# EasyEDA Pro project STM32F103C8T6_C6T6核心板.eprj, board PCB1_MicroUSB
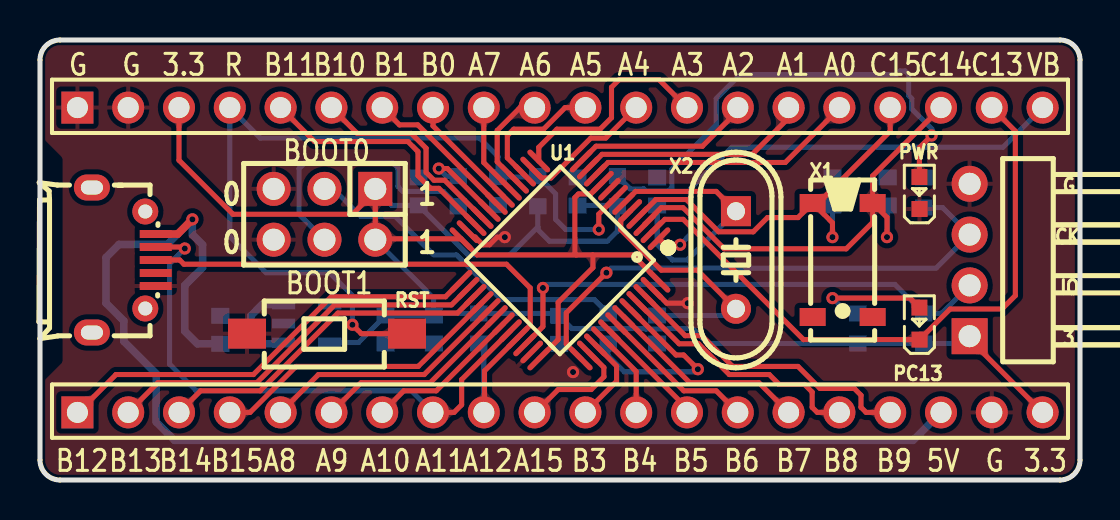
[diagram p6: board, top side]
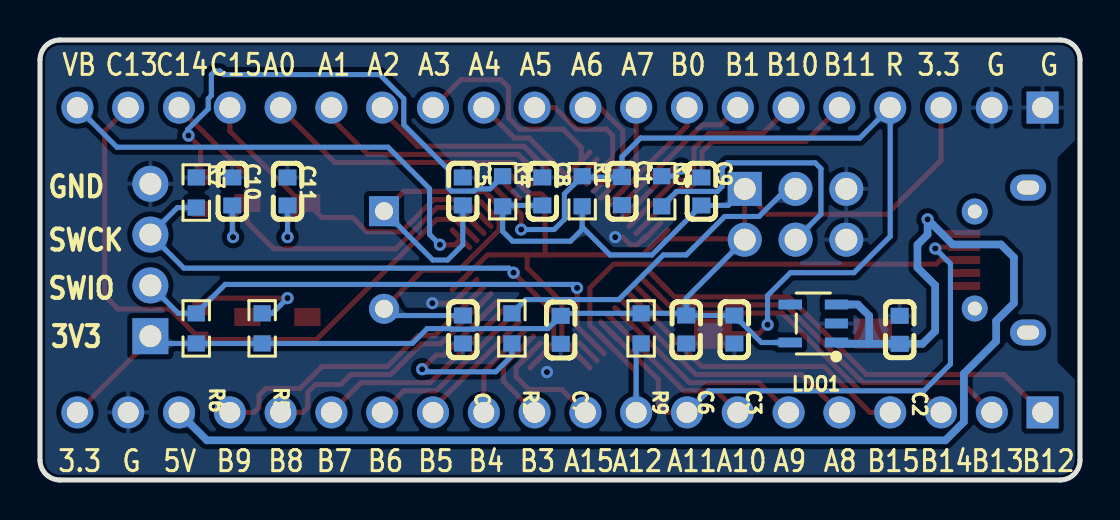
[diagram p7: board, bottom side, seen from below]

Outline 52 x 22 mm; copper layers: Top Layer, Bottom Layer. Coordinates in mm from the lower left corner of the outline.
Outline path: 0,21 0,1 arc(0.29,0.29) 1,0 51,0 arc(51.71,0.29) 52,1 52,21 arc(51.71,21.71) 51,22 1,22 arc(0.29,21.71) 0,21
Stack: Top Layer 0.035mm / Dielectric1 1.51mm FR4 er 4.5 / Bottom Layer 0.035mm

## Design rules (mm)
template: JLCPCB Capability(Two Layers Board)
spacing copperThickness1oz (default): track to track 0.102, other pairs 0.152 to 0.3
spacing copperThickness2oz: track to track 0.203, other pairs 0.152 to 0.3
track width copperThickness1oz (default): min 0.127, default 0.254, max 2.54
track width copperThickness2oz: min 0.203, default 0.254, max 2.54
differential pair differentialPair (default): width min 0.127, default 0.254, max 2.54; gap min 0.152, default 0.152
via viaSize (default): diameter min 0.5, default 0.61, max 10; hole min 0.3, default 0.305, max 6.3

## Placement (name value [footprint] x y rotation side)
C1  1uF  [C0603]  22.9 14.44 90 bottom
C2  1uF  [C0603]  9.02 7.51 270 bottom
C3  1uF  [C0603]  17.28 7.52 90 bottom
C4  20pF  [C0603]  30.86 7.52 90 bottom
C5  20pF  [C0603]  30.86 14.43 270 bottom
C6  100nF  [C0603]  19.69 7.52 90 bottom
C7  100nF  [C0603]  25.96 7.51 90 bottom
C8  100nF  [C0603]  26.88 14.43 270 bottom
C9  100nF  [C0603]  18.93 14.43 270 bottom
C10  6pF  [C0603]  42.38 14.43 270 bottom
C11  6pF  [C0603]  39.62 14.43 270 bottom
H1  PZ254V-12-6P  [HDR-TH_6P-P2.54-V-M-R2-C3-S2.54]  14.22 13.29 180 top
H2  PZ254R-11-04P  [HDR-TH_4P-P2.54-H-M-W10.4]  46.48 11 90 top
LDO1  ME6211C33M5G-N  [SOT-23-5_L3.0-W1.7-P0.95-LS2.8-BL]  13.34 7.83 90 bottom
PC13  -  [LED_0603]  43.97 7.87 90 top
PWR  -  [LED_0603]  43.97 14.4 90 top
R1  10kΩ  [R0603]  24.89 14.44 270 bottom
R2  100kΩ  [R0603]  28.41 7.58 90 bottom
R3  100kΩ  [R0603]  20.92 14.44 90 bottom
R4  510Ω  [R0603]  28.87 14.44 90 bottom
R5  510Ω  [R0603]  40.89 7.58 90 bottom
R6  10kΩ  [R0603]  44.19 7.58 270 bottom
R7  10kΩ  [R0603]  44.19 14.37 270 bottom
R9  1.5kΩ  [R0603]  21.94 7.58 90 bottom
RST  TS-1101-C-W  [SW-SMD_L6.0-W3.3-LS8.0]  14.35 7.32 0 top
U1  STM32F103C8T6  [LQFP-48_L7.0-W7.0-P0.50-LS9.0-BL]  26 11 135 top
U2  ZX-PZ2.54-1-20PZZ  [HDR-TH_20P-P2.54-V-M]  26 18.62 0 top
U3  ZX-PZ2.54-1-20PZZ  [HDR-TH_20P-P2.54-V-M]  26 3.38 0 top
USB1  MicroXNJ  [MICRO-USB-SMD_MICROXNJ]  4.19 11 270 top
X1  32.768kHz  [MC-306_4P-L8.0-W3.2-P5.5-BL]  40.13 11 270 top
X2  8MHz  [HC-49US_L11.5-W4.5-P4.88]  34.8 11 270 top

## Footprints (pads in the part's own frame, mm; a bottom-side part is the same pattern mirrored in y, then rotated)
C0603
  rect 0.8x0.9 smd: 1(-0.7,0) 2(0.7,0)
HC-49US_L11.5-W4.5-P4.88
  rect 1.5x1.5 hole 0.9: 1(-2.44,0)
  round 1.5 hole 0.9: 2(2.44,0)
HDR-TH_4P-P2.54-H-M-W10.4
  rect 1.8x1.8 hole 1.1: 1(-3.81,0)
  round 1.8 hole 1.1: 2(-1.27,0) 3(1.27,0) 4(3.81,0)
HDR-TH_6P-P2.54-V-M-R2-C3-S2.54
  rect 1.7x1.7 hole 1.1: 1(-2.54,-1.27)
  round 1.7 hole 1.1: 2(-2.54,1.27) 3(0,-1.27) 4(0,1.27) 5(2.54,-1.27) 6(2.54,1.27)
HDR-TH_20P-P2.54-V-M
  rect 1.6x1.6 hole 1.05: 1(-24.13,0)
  round 1.6 hole 1.05: 2(-21.59,0) 3(-19.05,0) 4(-16.51,0) 5(-13.97,0) 6(-11.43,0) 7(-8.89,0) 8(-6.35,0) 9(-3.81,0) 10(-1.27,0) 11(1.27,0) 12(3.81,0) 13(6.35,0) 14(8.89,0) 15(11.43,0) 16(13.97,0) 17(16.51,0) 18(19.05,0) 19(21.59,0) 20(24.13,0)
LED_0603
  rect 0.8x0.8 smd: 1(-0.851,-0.01) 2(0.75,-0.005)
LQFP-48_L7.0-W7.0-P0.50-LS9.0-BL
  oval 0.27x1.5 smd: 1(-2.75,-4.25) 2(-2.25,-4.25) 3(-1.75,-4.25) 4(-1.25,-4.25) 5(-0.75,-4.25) 6(-0.25,-4.25) 7(0.25,-4.25) 8(0.75,-4.25) 9(1.25,-4.25) 10(1.75,-4.25) 11(2.25,-4.25) 12(2.75,-4.25) 25(2.75,4.25) 26(2.25,4.25) 27(1.75,4.25) 28(1.25,4.25) 29(0.75,4.25) 30(0.25,4.25) 31(-0.25,4.25) 32(-0.75,4.25) 33(-1.25,4.25) 34(-1.75,4.25) 35(-2.25,4.25) 36(-2.75,4.25)
  oval 1.5x0.27 smd: 13(4.25,-2.75) 14(4.25,-2.25) 15(4.25,-1.75) 16(4.25,-1.25) 17(4.25,-0.75) 18(4.25,-0.25) 19(4.25,0.25) 20(4.25,0.75) 21(4.25,1.25) 22(4.25,1.75) 23(4.25,2.25) 24(4.25,2.75) 37(-4.25,2.75) 38(-4.25,2.25) 39(-4.25,1.75) 40(-4.25,1.25) 41(-4.25,0.75) 42(-4.25,0.25) 43(-4.25,-0.25) 44(-4.25,-0.75) 45(-4.25,-1.25) 46(-4.25,-1.75) 47(-4.25,-2.25) 48(-4.25,-2.75)
MC-306_4P-L8.0-W3.2-P5.5-BL
  rect 0.9x1.3 smd: 1(-2.85,-1.5) 2(2.85,-1.5) 3(2.85,1.5) 4(-2.85,1.5)
MICRO-USB-SMD_MICROXNJ
  rect 0.4x1.6 smd: 1(-1.3,1.597) 2(-0.65,1.597) 3(0,1.597) 4(0.65,1.597) 5(1.3,1.597)
  round 1.3 hole 0.7: 6(2.425,1.074) 9(-2.425,1.073)
  oval 1.3x1.8 hole 0.7x1.1: 7(3.625,-1.597) 8(-3.625,-1.597)
R0603
  rect 0.806x0.864 smd: 1(-0.753,0) 2(0.753,0)
SOT-23-5_L3.0-W1.7-P0.95-LS2.8-BL
  rect 0.49x1.157 smd: 1(-0.95,-1.153) 2(0,-1.153) 3(0.95,-1.153)
  rect 0.49x1.175 smd: 4(0.95,1.153) 5(-0.95,1.153)
SW-SMD_L6.0-W3.3-LS8.0
  rect 1.9x1.5 smd: 1(-4,0) 2(4,0)

## Nets
As in the schematic, except:
GND: C1.1 C2.1 C3.1 C4.1 C5.1 C6.1 C7.1 C8.1 C9.1 C10.1 C11.1 H1.5 H1.6 H2.4 LDO1.2 PWR.1 R7.1 RST.1 U1.8 U1.23 U1.35 U1.47 U2.1 U2.2 U3.19 USB1.5
PC13: PC13.1 U1.2 U2.19
RST: C1.2 R1.1 RST.2 U1.7 U2.4
$1N1202: PWR.2 R4.2
$1N1254: PC13.2 R5.2

Pads without a net: LDO1 4; USB1 4 6 7 8 9; X1 2 3

## Via types
v1: diameter 0.61, hole 0.305, Top Layer to Bottom Layer, 16 vias

## Routing (per net, layer and track width the routed paths; a pad name or vN(x,y) marks a point on that pad's centre or on a via; arc(x,y) is an arc through that point)
3V3: length 105.2
  Top Layer w0.254: 28.12,14.89 27.53,14.3 26.92,14.3 26.74,14.12 26.74,11.33 26.82,11.25 ; 16.76,14.43 H1.2 16.81,12.06 U1.24 21.86,11.25 26.82,11.25 ; 16.76,14.43 H1.1 ; 16.76,14.43 15.62,13.29 9.65,13.29 6.95,15.99 U2.3 ; 26.82,11.25 27.65,11.25 ; U1.48 29.63,11.25 27.65,11.25 ; U3.20 46.48,7.03 H2.1 ; 27.65,11.25 27.65,10.61 25.91,8.88 25.91,7.02 U1.36
  Bottom Layer w0.254: H2.1 46.12,6.83 R6.2 R5.1 33.38,6.83 32.64,7.57 31.45,7.57 31.42,7.54 30.29,7.54 30.26,7.57 26.6,7.57 C7.2 25.84,8.33 R9.2 19.8,8.33 C6.2 ; C8.2 28.82,13.73 R4.1 28.87,12.44 28.37,11.94 25.48,11.94 24.89,12.52 24.89,12.65 ; H1.2 19.69,9.09 C6.2 ; C6.2 C3.2 15.93,6.88 LDO1.5 ; 24.89,12.65 R1.2 ; 24.89,12.65 23.5,11.25 21.4,11.25 C9.2 17.59,13.73 H1.1
5V: length 71.4
  Top Layer w0.381: USB1.1 6.89,12.3 v1(7.62,13.03)
  Bottom Layer w0.381: 10.56,6.81 C2.2 7.87,6.81 7.24,7.44 7.24,9.73 8.13,10.62 8.13,11.76 7.62,12.27 v1(7.62,13.03) 6.37,11.78 3.95,11.78 3.3,11.13 3.3,8.84 4.19,7.95 4.19,6.94 5.81,5.32 5.81,2.91 6.73,1.98 43.65,1.98 U3.18 ; 10.56,6.81 12.11,6.81 LDO1.1 ; 10.56,6.81 10.54,6.83 10.54,8.21 11.11,8.78 LDO1.3
GND: length 4.4
  Top Layer w0.254: v1(32.38,8.84) 31.34,8.84 U1.47 ; U1.23 21.67,12.15 21.76,12.15 22.14,11.76 22.48,11.76 22.86,12.14 v1(23.24,12.14)
  vias: v1(26.65,5.4)
BOOT0: length 10.1
  Top Layer w0.254: 29.54,8.53 29.54,8.52 31.8,6.25 32.18,6.25 v1(32.89,5.54)
  Bottom Layer w0.254: v1(32.89,5.54) 32.77,5.41 29.21,5.41 28.41,6.22 R2.1
BOOT1: length 4.5
  Top Layer w0.254: v1(19.94,15.57) 20.37,15.57 22.46,13.47
  Bottom Layer w0.254: R3.2 20.32,15.19 v1(19.94,15.57)
D+: length 30
  Top Layer w0.254: USB1.3 6.98,11 7.2,10.79 23.33,10.79 24.51,9.6 24.51,7.74 22.22,5.46 22.22,3.42 U3.9
  Bottom Layer w0.254: R9.1 22.19,6.58 U3.9
D-: length 28.1
  Top Layer w0.254: v1(7.24,11.57) 7.16,11.65 USB1.2 ; U3.8 20.7,3.38 21.08,3.76 21.08,5.02 23.53,7.46
  Bottom Layer w0.254: v1(7.24,11.57) 6.48,10.81 6.48,5.79 7.81,4.46 18.57,4.46 U3.8
OSC32_IN: length 23.9
  Top Layer w0.254: U1.3 30.24,12.79 31.06,13.62 32.15,13.62 34.21,11.56 40.31,11.56 41.63,12.88 X1.4 ; U2.18 41.63,15.2 X1.4 ; X1.4 42.35,13.13 v1(42.35,12.14)
  Bottom Layer w0.254: v1(42.35,12.14) 42.38,12.18 C10.2
OSC32_OUT: length 20.6
  Top Layer w0.254: 29.89,13.12 30.79,14.02 32.32,14.02 33.93,12.41 35.66,12.41 36.37,13.12 37.9,13.12 X1.1 ; X1.1 38.92,13.85 42.51,17.44 U2.17 ; X1.1 39.62,12.86 v1(39.62,12.14)
  Bottom Layer w0.254: C11.2 v1(39.62,12.14)
OSC_IN: length 12.6
  Top Layer w0.254: 29.54,13.47 29.53,13.47 29.04,12.99 29.04,12.52 31.06,10.49 32.87,10.49 X2.2
  Bottom Layer w0.254: X2.2 34.46,8.22 C4.2
OSC_OUT: length 13.5
  Top Layer w0.254: X2.1 33.81,14.43 29.78,14.43 U1.6
  Bottom Layer w0.254: X2.1 32.36,11 31.62,11 30.86,11.76 C5.2
PA0: length 13.6
  Top Layer w0.254: U1.10 28.4,15.88 37.26,15.88 39.97,18.58 U2.16
PA1: length 11.6
  Top Layer w0.254: U1.11 28.1,16.28 35.61,16.28 37.43,18.1 U2.15
PA2: length 9
  Top Layer w0.254: U2.14 34.89,18.46 33.12,16.69 27.8,16.69 U1.12
PA3: length 11
  Top Layer w0.254: U1.13 24.94,16.64 25.84,17.54 28,17.54 28.57,18.11 28.57,19.64 28.96,20.02 30.95,20.02 U2.13
PA4: length 6.9
  Top Layer w0.254: U2.12 28.29,17.1 27.54,17.1 25.55,15.1 25.08,15.1 U1.14
PA5: length 6.8
  Top Layer w0.254: U2.11 26.26,18.62 25.18,17.54 23.69,17.54 23.37,17.22 23.37,16.11 U1.15
PA6: length 5.4
  Top Layer w0.254: U2.10 24,18.62 22.86,17.48 22.86,15.91 23.88,14.89
PA7: length 4.6
  Top Layer w0.254: 23.53,14.54 22.19,15.87 U2.9
PA8: length 12.6
  Top Layer w0.254: 22.46,8.53 19.21,5.27 13.92,5.27 U3.5
PA9: length 10.2
  Top Layer w0.254: U1.30 19.51,4.87 16.06,4.87 U3.6
PA10: length 7.9
  Top Layer w0.254: U3.7 18.19,4.46 19.81,4.46 U1.31
PA13: length 25.8
  Top Layer w0.254: v1(25.15,9.6) 25.15,7.67 U1.34
  Bottom Layer w0.254: v1(25.15,9.6) 25.32,9.78 42.74,9.78 R6.1 45.09,8.33 H2.2
PA14: length 27.3
  Top Layer w0.254: U1.37 26.31,6.8 26.31,8.36 v1(28.32,10.36)
  Bottom Layer w0.254: R7.2 45.13,13.62 H2.3 44.81,10.59 28.55,10.59 v1(28.32,10.36)
PA15: length 5.8
  Top Layer w0.254: U3.10 24.76,3.38 25.91,4.52 27.56,4.52 28.19,5.16 28.19,5.62 U1.38
PB0: length 5.9
  Top Layer w0.254: U2.8 19.65,17.7 U1.18
PB1: length 7.7
  Top Layer w0.254: U2.7 17.97,17.76 18.89,17.76 U1.19
PB3: length 4.5
  Top Layer w0.254: U1.39 28.83,5.7 28.83,4.94 U3.11
PB4: length 4.4
  Top Layer w0.254: 28.12,7.11 29.81,5.42 U3.12
PB5: length 5.7
  Top Layer w0.254: U3.13 32.35,3.59 28.47,7.46
PB6: length 7.9
  Top Layer w0.254: U3.14 33.81,4.46 32.19,4.46 U1.42
PB7: length 10.2
  Top Layer w0.254: U1.43 32.49,4.87 35.94,4.87 U3.15
PB8: length 12.8
  Top Layer w0.254: U3.16 38.86,3.38 38.61,3.63 38.61,4.4 38.23,4.78 36.96,4.78 36.46,5.27 34.47,5.27 32.93,6.81 31.96,6.81 29.89,8.88
PB9: length 15
  Top Layer w0.254: U3.17 41.3,3.38 41.05,3.63 41.05,4.24 40.71,4.58 39,4.58 37.9,5.68 34.63,5.68 33.1,7.22 32.26,7.22 U1.46
PB10: length 10.5
  Top Layer w0.254: 22.11,13.12 22.1,13.12 20.23,14.99 19.7,14.99 19.3,15.38 19.3,16.59 18.56,17.33 15.86,17.33 U2.6
PB11: length 12.9
  Top Layer w0.254: U2.5 13.73,16.92 18.39,16.92 18.9,16.42 18.9,15.21 19.53,14.58 19.94,14.58 U1.22
PB12: length 21.9
  Top Layer w0.254: U1.25 20.27,9.16 14.56,9.16 10.67,5.27 3.8,5.27 1.91,3.38 U3.1
PB13: length 19.6
  Top Layer w0.254: U1.26 20.57,8.75 14.73,8.75 10.84,4.87 5.9,4.87 U3.2
PB14: length 17.2
  Top Layer w0.254: U1.27 20.87,8.35 14.9,8.35 11.01,4.46 8.03,4.46 U3.3
PB15: length 14.9
  Top Layer w0.254: U3.4 10.5,3.38 12.8,5.68 18.91,5.68 22.11,8.88
PC13: length 31.7
  Top Layer w0.254: U2.19 48.77,17.44 48.77,9.22 48.1,8.55 45.51,8.55 PC13.1 38.17,7.02 32.16,13.03 31.24,13.03 30.62,12.41 U1.2
RST: length 42.6
  Top Layer w0.254: U1.7 27.94,13.29 v1(27.94,12.52) ; v1(15.62,7.76) 16.07,7.32 RST.2
  Bottom Layer w0.254: v1(15.62,7.76) 15.62,9.22 14.48,10.36 11.3,10.36 9.49,12.18 U2.4 11.01,17.1 21.97,17.1 22.9,16.17 C1.2 24.85,15.14 R1.1 25.78,14.3 25.78,13.03 26.29,12.52 v1(27.94,12.52)
VB: length 23.5
  Top Layer w0.254: U1.1 31.25,11.76 v1(32,11.76)
  Bottom Layer w0.254: v1(32,11.76) 32.52,12.28 32.52,14.57 34.59,16.64 48.15,16.64 U2.20
$1N988: length 16.8
  Bottom Layer w0.254: H1.3 14.67,14.56 16.05,13.18 17.76,13.18 19.69,11.25 20.83,11.25 23.06,9.02 27.72,9.02 R2.2
$1N1027: length 13.6
  Bottom Layer w0.254: R3.1 20.17,14.43 18.14,14.43 17.89,14.67 17.89,15.6 17.64,15.86 13.24,15.86 12.95,15.57 12.95,13.29 H1.4
$1N1202: length 24.6
  Top Layer w0.254: v1(44.58,17.22) 43.97,16.62 43.97,15.15
  Bottom Layer w0.254: v1(44.58,17.22) 44.6,17.25 44.6,17.54 43.59,18.55 43.59,19.07 43.43,19.22 43.43,20.27 43.25,20.45 43,20.45 42.82,20.27 35.01,20.27 33.81,19.07 33.81,17.76 31.59,15.54 31.59,14.61 31.43,14.45 30.3,14.45 30.19,14.56 29.5,14.56 R4.2
$1N1254: length 6.1
  Top Layer w0.254: v1(39.62,9.09) 43.5,9.09 PC13.2
  Bottom Layer w0.254: R5.2 40.39,8.33 v1(39.62,9.09)

## Copper pours and planes (outline as drawn; the poured copper is in the pictures)
GND on Top Layer: -2.03,25.1 54.23,25.1 54.23,-3.22 -2.03,-3.22
GND on Bottom Layer: -3.94,24.72 56.13,24.72 56.13,-4.88 -3.94,-4.88

Small or netless copper shapes (teardrops, artwork), in the pictures only: 74 on Top Layer, 70 on Bottom Layer

## Text on the board
Bottom Silkscreen Layer: G | 3.3 | R | B11 | B10 | B1 | B0 | A7 | A6 | A5 | A4 | A3 | A2 | A1 | A0 | C15 | C14 | C13 | VB | B12 | B13 | B14 | B15 | A8 | A9 | A10 | A11 | A12 | A15 | B3 | B4 | B5 | B6 | B7 | B8 | B9 | 5V | 3V3 | GND | SWCK | SWIO
Top Silkscreen Layer: CK | IO | G | 3 | B12 | B13 | B14 | 3.3 | B15 | R | A8 | B11 | B10 | A9 | A10 | B1 | A11 | B0 | A12 | A7 | A15 | A6 | A5 | B3 | A4 | B4 | A3 | B5 | A2 | B6 | B7 | A1 | B8 | A0 | C15 | B9 | C14 | 5V | C13 | VB | BOOT0 | BOOT1 | 0 | 1
